# Altium project UPS.PrjPcb (part 1 of 3)
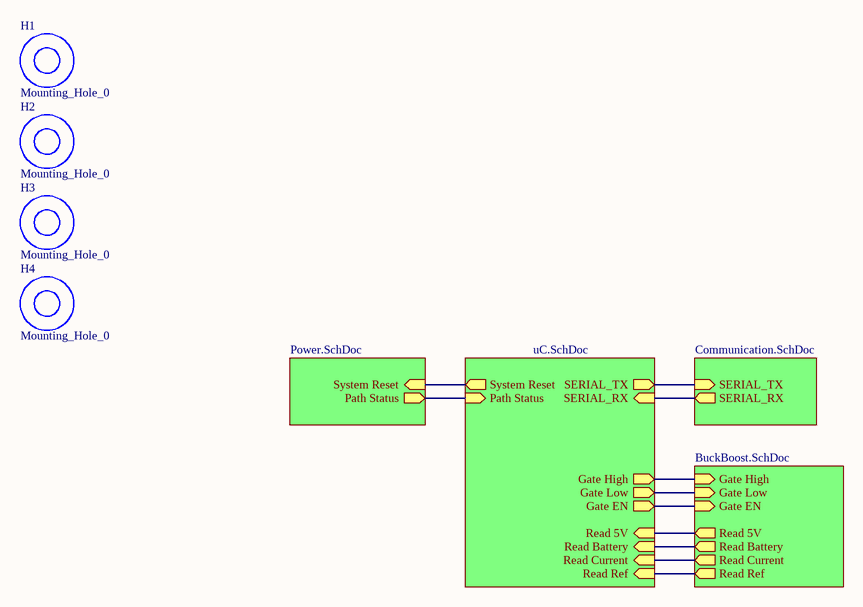
[diagram p0: Main.SchDoc]
5 sheets, 152 parts. Net scope: hierarchical (ports join the sheet entries above them; power ports are global).
Board file: UPS.PcbDoc
Sheets:
  Main.SchDoc
    Designator = uC.SchDoc
    Designator = Communication.SchDoc
    Designator = Power.SchDoc
    Designator = BuckBoost.SchDoc

## Sheet Main.SchDoc
size A4; SheetNumber: 1; SheetTotal: 5

### Parts
H1  Mounting_Hole_0  [MOUNTING_HOLE_M3]
H2  Mounting_Hole_0  [MOUNTING_HOLE_M3]
H3  Mounting_Hole_0  [MOUNTING_HOLE_M3]
H4  Mounting_Hole_0  [MOUNTING_HOLE_M3]

### Sub-sheets
Designator = uC.SchDoc: SERIAL_TX (out), SERIAL_RX (in), System Reset (out), Gate Low (out), Gate EN (out), Read 5V (in), Read Battery (in), Read Current (in), Read Ref (in), Gate High (out), Path Status (in)
Designator = Communication.SchDoc: SERIAL_TX (in), SERIAL_RX (out)
Designator = Power.SchDoc: System Reset (in), Path Status (out)
Designator = BuckBoost.SchDoc: Gate Low (in), Gate EN (in), Read 5V (out), Read Battery (out), Read Current (out), Read Ref (out), Gate High (in)

### Nets
Gate EN: sheet Designator/Gate EN, sheet Designator/Gate EN
Gate High: sheet Designator/Gate High, sheet Designator/Gate High
Gate Low: sheet Designator/Gate Low, sheet Designator/Gate Low
Path Status: sheet Designator/Path Status, sheet Designator/Path Status
Read 5V: sheet Designator/Read 5V, sheet Designator/Read 5V
Read Battery: sheet Designator/Read Battery, sheet Designator/Read Battery
Read Current: sheet Designator/Read Current, sheet Designator/Read Current
Read Ref: sheet Designator/Read Ref, sheet Designator/Read Ref
SERIAL_RX: sheet Designator/SERIAL_RX, sheet Designator/SERIAL_RX
SERIAL_TX: sheet Designator/SERIAL_TX, sheet Designator/SERIAL_TX
System Reset: sheet Designator/System Reset, sheet Designator/System Reset

### Library data of the parts
H1-H4 = Mounting_Hole_0: Mounting hole with no connectivity.

## Sheet uC.SchDoc: uC.SchDoc
size A4; Author: Daniel Sinko; Revision: A; SheetNumber: 2; SheetTotal: 5
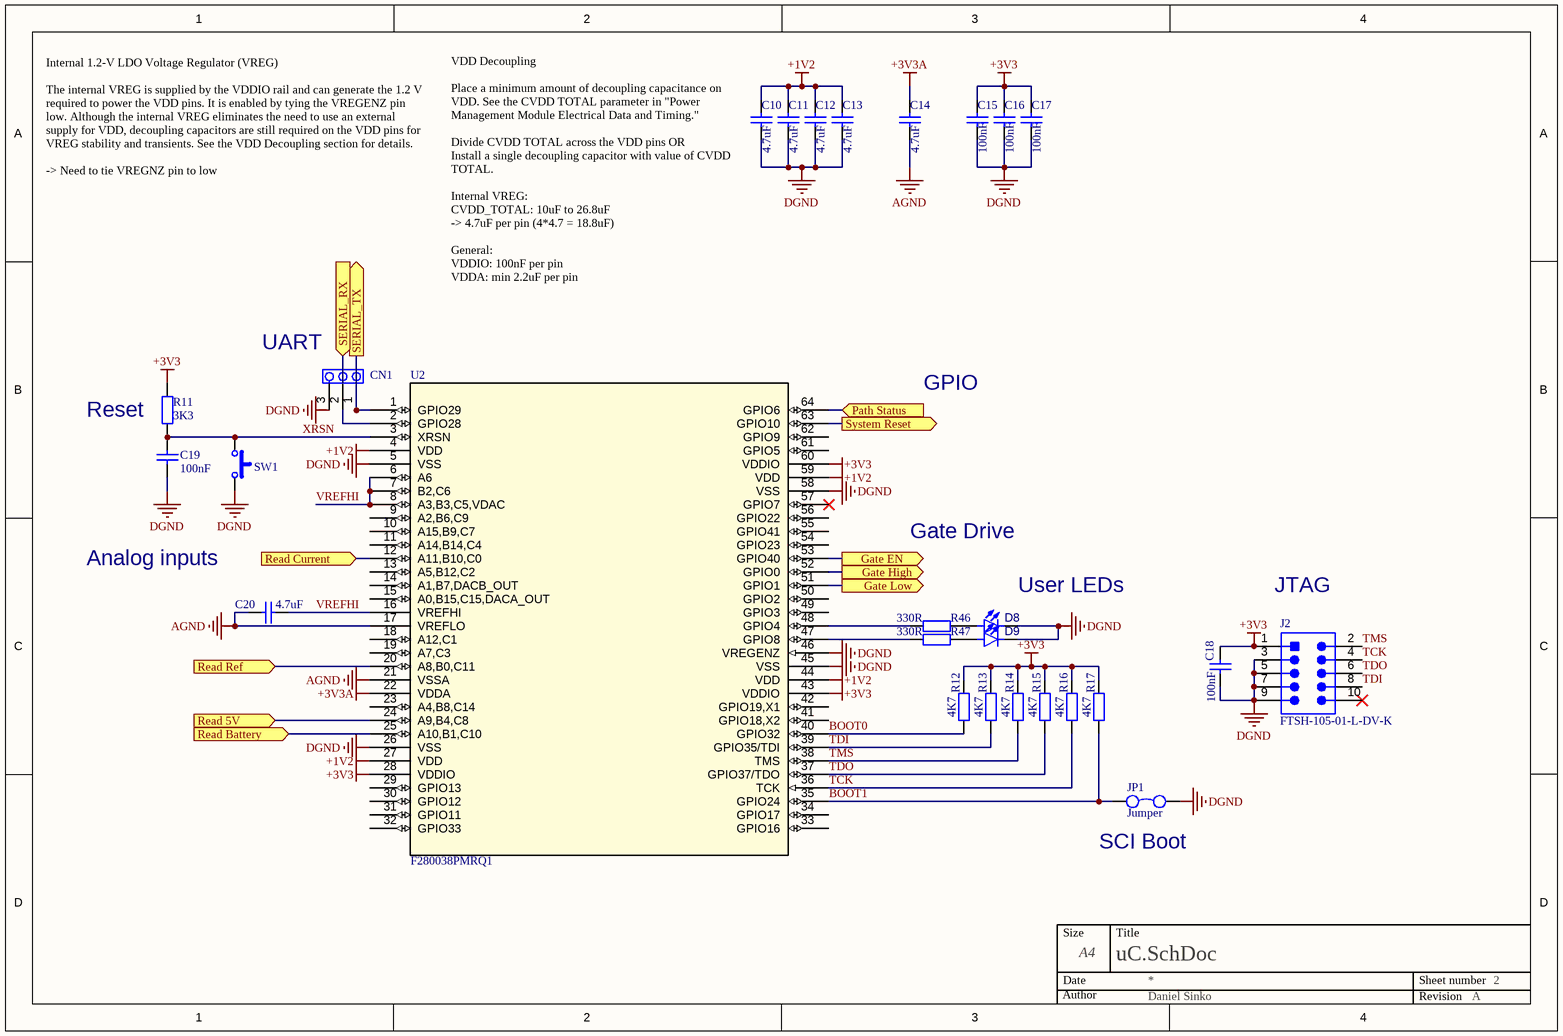
[diagram p1: uC.SchDoc]

### Parts
C10  4.7uF  [CAP0603]
C11  4.7uF  [CAP0603]
C12  4.7uF  [CAP0603]
C13  4.7uF  [CAP0603]
C14  4.7uF  [CAP0603]
C15  100nF  [CAP0603]
C16  100nF  [CAP0603]
C17  100nF  [CAP0603]
C18  100nF  [CAP0603]
C19  100nF  [CAP0603]
C20  4.7uF  [CAP0603]
CN1  Pins 1x3  [PIN-1X3]  (value not drawn)
D8  (no value)  [LED0603]
D9  (no value)  [LED0603]
J2  FTSH-105-01-L-DV-K  [CON-2x5-1.27]
JP1  Jumper  [PIN-1X2]
R11  3K3  [RES0603]
R12  4K7  [RES0603]
R13  4K7  [RES0603]
R14  4K7  [RES0603]
R15  4K7  [RES0603]
R16  4K7  [RES0603]
R17  4K7  [RES0603]
R46  330R  [RES0603]
R47  330R  [RES0603]
SW1  PTS526 Button  [PTS526 SMG15J SMTR2 LFS]  (value not drawn)
U2  F280038PMRQ1  [LQFP-64]

### Ports
Gate EN (out, see Main[3C], BuckBoost[1C]), Gate High (out, see Main[3C], BuckBoost[1B]), Gate Low (out, see Main[3C], BuckBoost[1C]), Path Status (in, see Main[2B], Power[1C]), Read 5V (in, see Main[3C], BuckBoost[1D]), Read Battery (in, see Main[3C], BuckBoost[1D]), Read Current (in, see Main[3C], BuckBoost[4D]), Read Ref (in, see Main[3C], BuckBoost[2D]), SERIAL_RX (in, see Main[3B], Communication[4A]), SERIAL_TX (out, see Main[3B], Communication[4A]), System Reset (out, see Main[2B], Power[3B])

### Nets
+1V2: C10.2 C11.2 C12.2 C13.2 U2.4(VDD) U2.27(VDD) U2.44(VDD) U2.59(VDD)
+3V3: C15.2 C16.2 C17.2 C18.2 J2.1 R11.2 R12.2 R13.2 R14.2 R15.2 R16.2 R17.2 U2.28(VDDIO) U2.43(VDDIO) U2.60(VDDIO)
+3V3A: C14.2 U2.22(VDDA)
AGND: C14.1 C20.1 U2.17(VREFLO) U2.21(VSSA)
DGND: C10.1 C11.1 C12.1 C13.1 C15.1 C16.1 C17.1 C18.1 C19.2 CN1.3 D8.1(K) D9.1(K) J2.3 J2.5 J2.7 J2.9 JP1.2 SW1.1 U2.5(VSS) U2.26(VSS) U2.45(VSS) U2.46(VREGENZ) U2.58(VSS)
BOOT0: R12.1 U2.40(GPIO32)
BOOT1: JP1.1 R17.1 U2.35(GPIO24)
Gate EN: U2.53(GPIO40) ; port Gate EN
Gate High: U2.52(GPIO0) ; port Gate High
Gate Low: U2.51(GPIO1) ; port Gate Low
Path Status: U2.64(GPIO6) ; port Path Status
Read 5V: U2.24(A9,B4,C8) ; port Read 5V
Read Battery: U2.25(A10,B1,C10) ; port Read Battery
Read Current: U2.12(A11,B10,C0) ; port Read Current
Read Ref: U2.20(A8,B0,C11) ; port Read Ref
SERIAL_TX: CN1.1 U2.1(GPIO29) ; port SERIAL_TX
System Reset: U2.63(GPIO10) ; port System Reset
TCK: J2.4 R16.1 U2.36(TCK)
TDI: J2.8 R13.1 U2.39(GPIO35/TDI)
TDO: J2.6 R15.1 U2.37(GPIO37/TDO)
TMS: J2.2 R14.1 U2.38(TMS)
VREFHI: C20.2 U2.6(A6) U2.7(B2,C6) U2.8(A3,B3,C5,VDAC) U2.16(VREFHI)
XRSN: C19.1 R11.1 SW1.2 U2.3(XRSN)
NetCN1_2: CN1.2 U2.2(GPIO28)
NetD8_2: D8.2(A) R46.1
NetD9_2: D9.2(A) R47.1
NetR46_2: R46.2 U2.48(GPIO4)
NetR47_2: R47.2 U2.47(GPIO8)

Not connected (* = marked no-connect by the designer): J2 10*; U2 9(A2,B6,C9) 10(A15,B9,C7) 11(A14,B14,C4) 13(A5,B12,C2) 14(A1,B7,DACB_OUT) 15(A0,B15,C15,DACA_OUT) 18(A12,C1) 19(A7,C3) 23(A4,B8,C14) 29(GPIO13) 30(GPIO12) 31(GPIO11) 32(GPIO33) 33(GPIO16) 34(GPIO17) 41(GPIO18,X2) 42(GPIO19,X1) 49(GPIO3) 50(GPIO2) 54(GPIO23) 55(GPIO41) 56(GPIO22) 57(GPIO7)* 61(GPIO5) 62(GPIO9)

### Notes on the sheet
- Internal 1.2-V LDO Voltage Regulator (VREG)
  The internal VREG is supplied by the VDDIO rail and can generate the 1.2 V required to power the VDD pins. It is enabled by tying the VREGENZ pin low. Although the internal VREG eliminates the need to use an external supply for VDD, decoupling capacitors are still required on the VDD pins for VREG stability and transients. See the VDD Decoupling section for details.
  -> Need to tie VREGNZ pin to low
- (near C10) VDD Decoupling
  Place a minimum amount of decoupling capacitance on VDD. See the CVDD TOTAL parameter in "Power Management Module Electrical Data and Timing."
  Divide CVDD TOTAL across the VDD pins OR
  Install a single decoupling capacitor with value of CVDD TOTAL.
  Internal VREG:
  CVDD_TOTAL: 10uF to 26.8uF
  -> 4.7uF per pin (4*4.7 = 18.8uF)
  General:
  VDDIO: 100nF per pin
  VDDA: min 2.2uF per pin
- (near CN1) UART
- Reset
- GPIO
- Analog inputs
- Gate Drive
- User LEDs
- (near J2) JTAG
- (near JP1) SCI Boot
- Size
- Date
- A4
- Title
- Sheet number
- Author
- Revision

### Library data of the parts
C10-C14 C20 = 4.7uF: Capacitor Ceramic 4.7uF 10V X5R 10% 0603 T/R; Manufacturer: Samsung; Manufacturer Part Number: CL10A475KP8NNWC; Voltage: *; Value: 4.7uF; Supplier: Mouser; Supplier Part Number: 187-CL10A475KP8NNWC; RoHS: No; Category: Ceramic Capacitors; Stock: 20365; Pricing: 1=0.1, 10=0.024, 50=0.024, 100=0.021, 1000=0.012, 10000=0.009 (USD)
C15-C19 = 100nF: Ceramic Capacitor, Multilayer, Ceramic, 25V, 10% +Tol, 10% -Tol, X7R, 15% TC, 0.1uF, Surface Mount, 0603; Manufacturer: Samsung; Manufacturer Part Number: CL10B104KA8WPNC; Multilayer: Yes; Reference Standard: AEC-Q200; Voltage: *; Value: 100nF; Supplier: Mouser; Supplier Part Number: 187-CL10B104KA8WPNC; RoHS: Yes; Category: Ceramic Capacitors; Stock: 62899; Pricing: 1=0.1, 10=0.026, 50=0.026, 100=0.018, 1000=0.014, 10000=0.009 (USD); Mounting Technology: Surface Mount; Pins: 2; Dielectric Material: Ceramic; Package Shape: Rectangular; Case/Package: 0603; Terminal Finish: Nickel; Min Operating Temperature: -55°C; Max Operating Temperature: 125°C; JESD-609 Code: e3; Capacitor Type: Ceramic; Tolerance  (fill in as +-): 10%; Packaging: Tape and Reel; Tolerance (fill in as +-): 10%; Rated DC Voltage (URdc): 25V; Temperature Characteristics Code: X7R; Termination: Wraparound; Reach SVHC Compliant: Yes; RoHS Compliant: Yes; ComponentLink1URL: https://datasheet.ciiva.com:443/pdfs/VipMasterIC/IC/SEMS/SEMS-S-A0005596039/SEMS-S-A0005592818-1.pdf?src-supplier=IHS+Markit; ComponentLink1Description: https://datasheet.ciiva.com:443/pdfs/VipMasterIC/IC/SEMS/SEMS-S-A0005596039/SEMS-S-A0005592818-1.pdf?src-supplier=IHS+Markit; ComponentLink2URL: http://www.samsungsem.com/kr/support/library/product-catalog/mlcc.jsp?src-supplier=Digikey; ComponentLink2Description: http://www.samsungsem.com/kr/support/library/product-catalog/mlcc.jsp?src-supplier=Digikey; ComponentLink3URL: http://www.samsungsem.com/kr/support/product-search/mlcc/CL10B104KA8WPNC.jsp?src-supplier=Digikey; ComponentLink3Description: http://www.samsungsem.com/kr/support/product-search/mlcc/CL10B104KA8WPNC.jsp?src-supplier=Digikey; ComponentLink4URL: http://www.samsungsem.com/servlet/FileDownload?filename=productcatalog/pdf/MLCC.pdf&src-supplier=Avnet; ComponentLink4Description: http://www.samsungsem.com/servlet/FileDownload?filename=productcatalog/pdf/MLCC.pdf&src-supplier=Avnet; ComponentLink5URL: https://datasheet.octopart.com/CL10B104KA8WPNC-Samsung-Electro-Mechanics-datasheet-148763375.pdf?src-supplier=Future+Electronics; ComponentLink5Description: https://datasheet.octopart.com/CL10B104KA8WPNC-Samsung-Electro-Mechanics-datasheet-148763375.pdf?src-supplier=Future+Electronics; ComponentLink6URL: https://datasheet.octopart.com/CL10B104KA8WPNC-Samsung-datasheet-8326407.pdf?src-supplier=TME; ComponentLink6Description: https://datasheet.octopart.com/CL10B104KA8WPNC-Samsung-datasheet-8326407.pdf?src-supplier=TME
CN1 = Pins 1x3: 1x3 2.54mm; Part Class: Connector; Order Code: 855-M50-3530342; CompType: M50-3530342; Distributor: Mouser; Package: SMD 1.27mm
D8 D9 = LED Green: Single Color LED, Bright Green, Water Clear, 1.1mm; Manufacturer: Wurth Electronics; Manufacturer Part Number: 150060VS75000; Shape: Rectangular; Forward Current: 30mA; Luminous Intensity-Nom: 40mcd; Channels: 1; Viewing Angle: 140°; Overall Height: 0.7mm; Supplier: Mouser; Supplier Part Number: 710-150060VS75000; RoHS: Yes; Category: LEDs; Stock: 96633; Pricing: 1=0.15, 10=0.15, 50=0.142, 100=0.122, 1000=0.116, 10000=0.116 (USD); Mounting Technology: Surface Mount; Pins: 2; Color: Green; Min Operating Temperature: -40°C; Max Operating Temperature: 85°C; Lens Style: WATER CLEAR; Optoelectronic Device Type: SINGLE COLOR LED; Packaging: Tape and Reel; Size: 1.1mm; Terminal Pitch: 1.6mm; Reach SVHC Compliant: Yes; RoHS Compliant: Yes; ComponentLink1URL: https://datasheet.ciiva.com:443/pdfs/VipMasterIC/IC/MIDC/MIDC-S-A0007768636/MIDC-S-A0007768636-1.pdf?src-supplier=IHS+Markit; ComponentLink1Description: https://datasheet.ciiva.com:443/pdfs/VipMasterIC/IC/MIDC/MIDC-S-A0007768636/MIDC-S-A0007768636-1.pdf?src-supplier=IHS+Markit; ComponentLink2URL: https://datasheet.ciiva.com/29562/150060vs75000-29562919.pdf?src-supplier=Digikey; ComponentLink2Description: https://datasheet.ciiva.com/29562/150060vs75000-29562919.pdf?src-supplier=Digikey
J2 = Connector_10Pin: Board Connector, 10 Contact(s), 2 Row(s), Male, Straight, 0.05 inch Pitch, Surface Mount Terminal, Locking; Manufacturer: Samtec; Manufacturer Part Number: FTSH-105-01-L-DV-K-P-TR; Connector Type: Header; Max Voltage: 0V; Current capacity: 3.4A; Safety Related: No; Order Code: 200-FTSH10501LDVK; Option: General Purpose; Contact Pattern: RECTANGULAR; Contact Style: SQ PIN-SKT; Mating Information: MULTIPLE MATING PARTS AVAILABLE; Number Of Connectors: 1; Number Of PCB Rows: 2; Number of Contacts: 10; Body Breadth: 0.135inch; Body Length: 0.25inch; PCB Contact Row Spacing: 4.064mm; Plating Thickness: 10uin; Reference Standard: UL; Reliability: COMMERCIAL; RoHS Compliant: Yes; Min Operating Temperature: -55°C; Mounting Technology: SMD; Gender: Male; Pins: 10; Max Operating Temperature: 125°C; Distributor: Mouser; Package: SMD; CompType: FTSH-105-01-L-DV-K; Supplier: Mouser; Supplier Part Number: 200-FTSH10501LDVKP; RoHS: Yes; Category: Headers and Wire Housings; Stock: 22779; Pricing: 1=2.88, 10=2.88, 50=2.88, 100=2.27, 1000=1.59, 10000=1.34 (USD); Contact Material: Bronze; Contact Finish - Mating: GOLD (10) OVER NICKEL (50); Contact Finish - Termination: Matte Tin (Sn) - with Nickel (Ni) barrier; Insulation Material: Polymer; JESD-609 Code: e3; Contact Gender: Male; Filter Feature: No; Mixed Contacts: No; Mounting Style: STRAIGHT; Number of Rows Loaded: 2; PCB Contact Pattern: RECTANGULAR; Termination: SMD/SMT; Mating Contact Pitch: 0.05inch; Mating Contact Row Spacing: 0.05inch; Mounting Option 1: LOCKING; Terminal Pitch: 1.27mm; DIN Conformance: No; IEC Conformance: No; MIL Conformance: No; Reach SVHC Compliant: Yes; ComponentLink1URL: https://datasheet.ciiva.com:443/pdfs/VipMasterIC/IC/SAMI/SAMI-S-A0006911451/SAMI-S-A0006911451-1.pdf?src-supplier=IHS+Markit; ComponentLink1Description: https://datasheet.ciiva.com:443/pdfs/VipMasterIC/IC/SAMI/SAMI-S-A0006911451/SAMI-S-A0006911451-1.pdf?src-supplier=IHS+Markit; ComponentLink2URL: https://datasheet.ciiva.com/26837/getdatasheetpartid-233500-26837930.pdf?src-supplier=Verical; ComponentLink2Description: https://datasheet.ciiva.com/26837/getdatasheetpartid-233500-26837930.pdf?src-supplier=Verical; ComponentLink3URL: https://datasheet.ciiva.com/10245/ftsh-mt-10245287.pdf?src-supplier=Avnet; ComponentLink3Description: https://datasheet.ciiva.com/10245/ftsh-mt-10245287.pdf?src-supplier=Avnet
JP1 = Jumper: Interconnection Device; Manufacturer: Harwin; Manufacturer Part Number: M7582-46; Manufacturer Series: M75; Additional Feature: ROHS COMPLIANT; Body/Shell Style: PLUG; Contact Pattern: RECTANGULAR; Contact Resistance: 20mR; Contact Style: SQ PIN-SKT; Dielectric Withstanding Voltage (AC): 500V; Insertion Force-Max: 6.672N; Insulation Resistance: 5GR; Number Of Connectors: 1; Rated Current (Signal): 1A; Number of Contacts: 2; Body Breadth: 0.094inch; Body Depth: 0.236inch; Body Length: 0.197inch; Mating Contact Pitch: 0.1inch; Reference Standard: UL; Reliability: COMMERCIAL; Supplier: Mouser; Supplier Part Number: 855-M7582-46; RoHS: Yes; Category: Uncategorized; Stock: 4991; Pricing: 1=0.19, 10=0.125, 50=0.125, 100=0.104, 1000=0.075, 10000=0.072 (USD); Contact Material: Bronze; Contact Finish - Mating: SN; Contact Finish - Termination: Tin (Sn); Insulation Color: Black; Insulation Material: Glass; Min Operating Temperature: -55°C; Max Operating Temperature: 105°C; Connector Type: Interconnection Device; JESD-609 Code: e3; Contact Gender: Female; Mounting Style: STRAIGHT; Number of Rows Loaded: 1; Reach SVHC Compliant: Yes; RoHS Compliant: Yes; ComponentLink1URL: https://datasheet.ciiva.com:443/pdfs/VipMasterIC/IC/HRWN/HRWNS06295/HRWNS06295-1.pdf?src-supplier=IHS+Markit; ComponentLink1Description: https://datasheet.ciiva.com:443/pdfs/VipMasterIC/IC/HRWN/HRWNS06295/HRWNS06295-1.pdf?src-supplier=IHS+Markit; ComponentLink2URL: http://www.mouser.com/ds/2/181/M7580-M7583-351524.pdf?src-supplier=Mouser; ComponentLink2Description: http://www.mouser.com/ds/2/181/M7580-M7583-351524.pdf?src-supplier=Mouser; ComponentLink3URL: https://cdn.harwin.com/pdfs/Harwin_PC_Connectors_M20.pdf?src-supplier=Digikey; ComponentLink3Description: https://cdn.harwin.com/pdfs/Harwin_PC_Connectors_M20.pdf?src-supplier=Digikey; ComponentLink4URL: http://www.harwin.com/include/downloads/pdfs/2010PAGE125.PDF?src-supplier=Avnet; ComponentLink4Description: http://www.harwin.com/include/downloads/pdfs/2010PAGE125.PDF?src-supplier=Avnet
R11 = 3K3: Fixed Resistor, Metal Glaze/thick Film, 0.1W, 3300ohm, 75V, 1% +/-Tol, 100ppm/Cel, Surface Mount, 0603; Manufacturer: Yageo; Manufacturer Part Number: RC0603FR-073K3L; Power: 100mW; Additional Feature: LASER TRIMMABLE; Rated Temperature: 70°C; Temperature Coefficient: 100ppm/°C; Package Height: 0.45mm; Package Length: 1.6mm; Package Width: 0.8mm; Supplier: Mouser; Tolerance: 1%; Supplier Part Number: 603-RC0603FR-073K3L; RoHS: Yes; Category: Chip SMD Resistors; Stock: 104017; Pricing: 1=0.1, 10=0.012, 50=0.012, 100=0.007, 1000=0.005, 10000=0.004 (USD); Mounting Technology: Surface Mount; Pins: 2; Package Shape: Rectangular; Case/Package: 0603; Terminal Finish: Nickel; Min Operating Temperature: -55°C; Max Operating Temperature: 155°C; JESD-609 Code: e3; Resistor Type: FIXED RESISTOR; Packaging: Tape and Reel; Technology: METAL GLAZE/THICK FILM; Termination: Wraparound; Working Voltage: 75V; Reach SVHC Compliant: Yes; RoHS Compliant: Yes; ComponentLink1URL: https://datasheet.ciiva.com:443/pdfs/VipMasterIC/IC/YAGO/YAGO-S-A0008145938/YAGO-S-A0008145938-1.pdf?src-supplier=IHS+Markit; ComponentLink1Description: https://datasheet.ciiva.com:443/pdfs/VipMasterIC/IC/YAGO/YAGO-S-A0008145938/YAGO-S-A0008145938-1.pdf?src-supplier=IHS+Markit; ComponentLink2URL: https://datasheet.ciiva.com/7746/1686128-7746345.pdf?src-supplier=Element14; ComponentLink2Description: https://datasheet.ciiva.com/7746/1686128-7746345.pdf?src-supplier=Element14; ComponentLink3URL: https://datasheet.ciiva.com/46440/1868787-46440905.pdf?src-supplier=Element14; ComponentLink3Description: https://datasheet.ciiva.com/46440/1868787-46440905.pdf?src-supplier=Element14; Value: 3K3; Construction: Chip; ComponentLink4URL: https://datasheet.ciiva.com/2453/pyu-r-int-thick-7-2453926.pdf?src-supplier=Digikey; ComponentLink4Description: https://datasheet.ciiva.com/2453/pyu-r-int-thick-7-2453926.pdf?src-supplier=Digikey; ComponentLink5URL: https://datasheet.ciiva.com/2453/pyu-r-int-thick-7-2453927.pdf?src-supplier=Digikey; ComponentLink5Description: https://datasheet.ciiva.com/2453/pyu-r-int-thick-7-2453927.pdf?src-supplier=Digikey; ComponentLink6URL: https://datasheet.ciiva.com/7746/443971-7746344.pdf?src-supplier=Element14; ComponentLink6Description: https://datasheet.ciiva.com/7746/443971-7746344.pdf?src-supplier=Element14; ComponentLink7URL: https://datasheet.ciiva.com/7746/443971-7746346.pdf?src-supplier=Element14; ComponentLink7Description: https://datasheet.ciiva.com/7746/443971-7746346.pdf?src-supplier=Element14
R12-R17 = 4K7: Fixed Resistor, Metal Glaze/thick Film, 0.1W, 4700ohm, 75V, 1% +/-Tol, 100ppm/Cel, Surface Mount, 0603; Manufacturer: Yageo; Manufacturer Part Number: AC0603FR-134K7L; Additional Feature: LASER TRIMMABLE; Rated Temperature: 70°C; Temperature Coefficient: 100ppm/°C; Package Height: 0.45mm; Package Length: 1.6mm; Package Width: 0.8mm; Reference Standard: AEC-Q200; Value: 4K7; Supplier Part Number: 603-AC0603FR-134K7L; RoHS: Yes; Category: Chip SMD Resistors; Stock: 48833; Pricing: 1=0.1, 10=0.009, 50=0.009, 100=0.006, 1000=0.005, 10000=0.003 (USD); Mounting Technology: Surface Mount; Pins: 2; Package Shape: Rectangular; Case/Package: 0603; Terminal Finish: Nickel; Min Operating Temperature: -55°C; Max Operating Temperature: 155°C; JESD-609 Code: e3; Resistor Type: FIXED RESISTOR; Construction: Chip; Packaging: Tape and Reel; Technology: METAL GLAZE/THICK FILM; Termination: Wraparound; Working Voltage: 75V; Reach SVHC Compliant: Yes; RoHS Compliant: Yes; ComponentLink1URL: https://datasheet.ciiva.com:443/pdfs/VipMasterIC/IC/YAGO/YAGO-S-A0003597364/YAGO-S-A0003597364-1.pdf?src-supplier=IHS+Markit; ComponentLink1Description: https://datasheet.ciiva.com:443/pdfs/VipMasterIC/IC/YAGO/YAGO-S-A0003597364/YAGO-S-A0003597364-1.pdf?src-supplier=IHS+Markit; ComponentLink2URL: https://datasheet.octopart.com/AC0603FR-134K7L-Yageo-datasheet-151884373.pdf?src-supplier=Future+Electronics; ComponentLink2Description: https://datasheet.octopart.com/AC0603FR-134K7L-Yageo-datasheet-151884373.pdf?src-supplier=Future+Electronics
R46 R47 = 330R: Fixed Resistor, Metal Glaze/thick Film, 0.1W, 330ohm, 75V, 1% +/-Tol, 100ppm/Cel, Surface Mount, 0603; Manufacturer: Walsin Technologies; Manufacturer Part Number: WR06X3300FTL; Rated Temperature: 70°C; Temperature Coefficient: 100ppm/°C; Working Voltage: 50V; Package Height: 0.45mm; Package Length: 1.6mm; Package Width: 0.8mm; Value: 330R; Supplier Part Number: 791-WR06X3300FTL; RoHS: Yes; Category: Chip SMD Resistors; Stock: 10415; Pricing: 1=0.1, 10=0.007, 50=0.007, 100=0.003, 1000=0.003, 10000=0.001 (USD); Mounting Technology: Surface Mount; Pins: 2; Package Shape: Rectangular; Case/Package: 0603; Terminal Finish: Nickel; Min Operating Temperature: -55°C; Max Operating Temperature: 155°C; JESD-609 Code: e3; Resistor Type: FIXED RESISTOR; Packaging: Tape and Reel; Termination: Wraparound; Construction: Chip; Technology: METAL GLAZE/THICK FILM; Reach SVHC Compliant: Yes; RoHS Compliant: Yes; ComponentLink1URL: https://datasheet.ciiva.com:443/pdfs/VipMasterIC/IC/WATC/WATC-S-A0005256878/WATC-S-A0005256878-1.pdf?src-supplier=IHS+Markit; ComponentLink1Description: https://datasheet.ciiva.com:443/pdfs/VipMasterIC/IC/WATC/WATC-S-A0005256878/WATC-S-A0005256878-1.pdf?src-supplier=IHS+Markit; ComponentLink2URL: http://www.farnell.com/datasheets/1960319.pdf?src-supplier=Farnell; ComponentLink2Description: http://www.farnell.com/datasheets/1960319.pdf?src-supplier=Farnell; ComponentLink3URL: https://datasheet.octopart.com/WR06X3300FTL-Walsin-Technologies-datasheet-48038251.pdf?src-supplier=Element14; ComponentLink3Description: https://datasheet.octopart.com/WR06X3300FTL-Walsin-Technologies-datasheet-48038251.pdf?src-supplier=Element14; ComponentLink4URL: https://www.verical.com/server-webapp/html/getDatasheet?partID=414704&src-supplier=Verical; ComponentLink4Description: https://www.verical.com/server-webapp/html/getDatasheet?partID=414704&src-supplier=Verical
SW1 = PTS526 Button: PTS526 Series SPST-NO Off-Mom 160 gf Top Actuated J Lead SMT Tactile Switch; Part Class: Other; Manufacturer: ITT C&K; Manufacturer Part Number: PTS526SMG15JSMTR2LFS; CompType: DTSM 32N/SMD; Note: DIPTRONICS; Distributor: RET; Order Code: 52-01-71; Supplier: Mouser; Supplier Part Number: 611-TS526SMG15JSMR2L; RoHS: No; Category: Tactile Switches; Stock: 4081; Pricing: 1=0.14, 10=0.118, 50=0.118, 100=0.112, 1000=0.086, 10000=0.083 (USD); ComponentLink1URL: https://dznh3ojzb2azq.cloudfront.net/products/Tactile/PTS526/documents/datasheet.pdf?src-supplier=Digikey; ComponentLink1Description: https://dznh3ojzb2azq.cloudfront.net/products/Tactile/PTS526/documents/datasheet.pdf?src-supplier=Digikey; ComponentLink2URL: https://datasheet.octopart.com/PTS526SMG15JSMTR2LFS-C%26K-Components-datasheet-138817219.pdf?src-supplier=Future+Electronics; ComponentLink2Description: https://datasheet.octopart.com/PTS526SMG15JSMTR2LFS-C%26K-Components-datasheet-138817219.pdf?src-supplier=Future+Electronics; ComponentLink3URL: https://datasheet.octopart.com/PTS526SMG15JSMTR2LFS-C%26K-Components-datasheet-166147767.pdf?src-supplier=TME; ComponentLink3Description: https://datasheet.octopart.com/PTS526SMG15JSMTR2LFS-C%26K-Components-datasheet-166147767.pdf?src-supplier=TME
U2 = F280038CPMRQ1: Automotive C2000™ 32-bit MCU 120-MHz 384-KB flash, FPU, TMU with CLA, AES and CAN-FD; Mfr_Name: Texas Instruments; CompType: TMS320F280038-Q1; Type: DEV; Copyright: Copyright (C) 2023 Ultra Librarian. All rights reserved.; Manufacturer_Part_Number: F280038PMRQ1; RefDes: RefDes; Footprint: LQFP64; Distributor: TI; Supplier: Mouser; Supplier Part Number: 595-F280038PMRQ1; Manufacturer: Texas Instruments; Manufacturer Part Number: F280038PMRQ1; RoHS: No; Category: Uncategorized; Stock: 993; Pricing: 1=7.79, 10=7.04, 50=6.72, 100=5.83, 1000=4.35, 10000=4.35 (USD)

## Sheet Communication.SchDoc
size A4; SheetNumber: 4; SheetTotal: 5
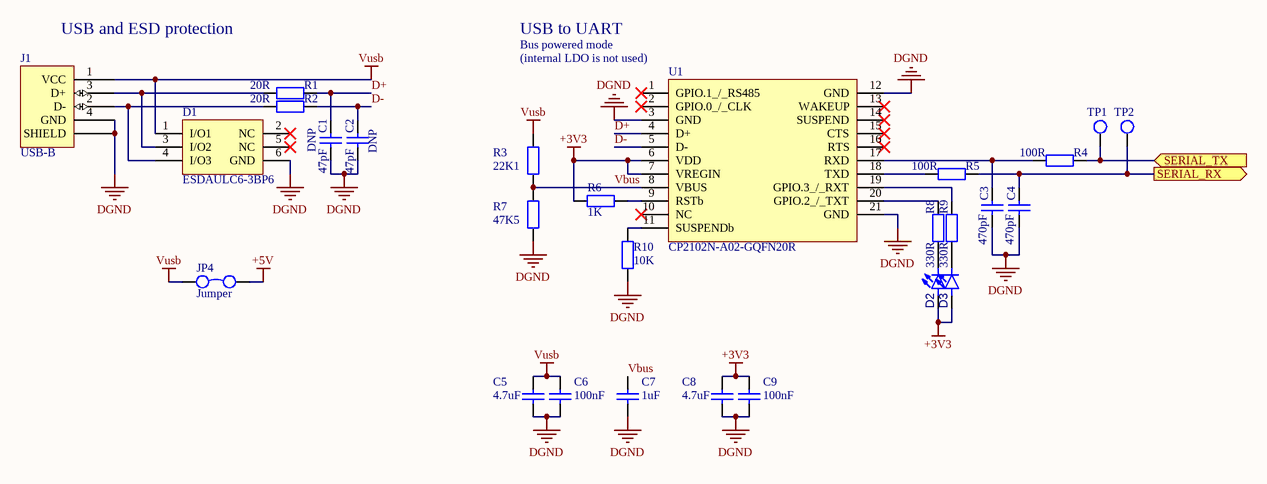
[diagram p2: Communication.SchDoc]

### Parts
C1  DNP  value 47pF  [CAP0603]
C2  DNP  value 47pF  [CAP0603]
C3  470pF  [CAP0603]
C4  470pF  [CAP0603]
C5  4.7uF  [CAP0603]
C6  100nF  [CAP0603]
C7  1uF  [CAP0603]
C8  4.7uF  [CAP0603]
C9  100nF  [CAP0603]
D1  ESDAULC6-3BP6  [SOT-666]
D2  (no value)  [LED0603]
D3  (no value)  [LED0603]
J1  USB-B  [USB-B-FEMALE]
JP4  Jumper  [PIN-1X2]
R1  20R  [RES0603]
R2  20R  [RES0603]
R3  22K1  [RES0603]
R4  100R  [RES0603]
R5  100R  [RES0603]
R6  1K  [RES0603]
R7  47K5  [RES0603]
R8  330R  [RES0603]
R9  330R  [RES0603]
R10  10K  [RES0603]
TP1  Test Point  [TP-1.5HOLE]  (value not drawn)
TP2  Test Point  [TP-1.5HOLE]  (value not drawn)
U1  CP2102N-A02-GQFN20R  [QFN-20]

### Ports
SERIAL_RX (out, see Main[2B], uC[1B]), SERIAL_TX (in, see Main[2B], uC[1B])

### Nets
+3V3: C8.2 C9.1 D2.2(A) D3.2(A) R6.1 U1.6(VDD) U1.7(VREGIN)
+5V: JP4.2
DGND: C1.1 C2.1 C3.1 C4.1 C5.1 C6.2 C7.1 C8.1 C9.2 D1.6(GND) J1.0(SHIELD) J1.4(GND) R7.1 R10.1 U1.3(GND) U1.12(GND) U1.21(GND)
Vusb: C5.2 C6.1 D1.1(I/O1) J1.1(VCC) JP4.1 R3.2
D+: C1.2 R1.1 U1.4(D+)
D-: C2.2 R2.1 U1.5(D-)
SERIAL_RX: C4.2 R5.2 TP2.1 ; port SERIAL_RX
SERIAL_TX: R4.2 TP1.1 ; port SERIAL_TX
Vbus: C7.2 R3.1 R7.2 U1.8(VBUS)
NetC3_2: C3.2 R4.1 U1.17(RXD)
NetD1_3: D1.3(I/O2) J1.3(D+) R1.2
NetD1_4: D1.4(I/O3) J1.2(D-) R2.2
NetD2_1: D2.1(K) R8.2
NetD3_1: D3.1(K) R9.2
NetR5_1: R5.1 U1.18(TXD)
NetR6_2: R6.2 U1.9(RSTb)
NetR8_1: R8.1 U1.20(GPIO.2_/_TXT)
NetR9_1: R9.1 U1.19(GPIO.3_/_RXT)
NetR10_2: R10.2 U1.11(SUSPENDb)

Not connected (* = marked no-connect by the designer): D1 2(NC)* 5(NC)*; U1 1(GPIO.1_/_RS485)* 2(GPIO.0_/_CLK)* 10(NC)* 13(WAKEUP)* 14(SUSPEND)* 15(CTS)* 16(RTS)*

### Notes on the sheet
- USB and ESD protection
- USB to UART
- Bus powered mode
- (near U1) (internal LDO is not used)

### Library data of the parts
C1 C2 = 47pF: Ceramic Capacitor, Multilayer, Ceramic, 100V, 5% +Tol, 5% -Tol, C0G, 30ppm/Cel TC, 0.000047uF, Surface Mount, 0603; Manufacturer: KEMET; Manufacturer Part Number: C0603C470J1GACTU; Multilayer: Yes; Voltage: *; Supplier: Mouser; Supplier Part Number: 80-C0603C470J1G; RoHS: Yes; Category: Ceramic Capacitors; Stock: 43381; Pricing: 1=0.1, 10=0.026, 50=0.026, 100=0.016, 1000=0.012, 10000=0.007 (USD); Mounting Technology: Surface Mount; Pins: 2; Dielectric Material: Ceramic; Package Shape: Rectangular; Case/Package: 0603; Terminal Finish: Nickel; Min Operating Temperature: -55°C; Max Operating Temperature: 125°C; JESD-609 Code: e3; Capacitor Type: Ceramic; Tolerance  (fill in as +-): 5%; Package Style: SMTMeter; Packaging: Tape and Reel; Tolerance (fill in as +-): 5%; Rated DC Voltage (URdc): 100V; Temperature Characteristics Code: C0G; Termination: Wraparound; Length: 1.6mm; Width: 0.8mm; Height: 0.8mm; Reach SVHC Compliant: Yes; RoHS Compliant: Yes; ComponentLink1URL: https://datasheet.ciiva.com:443/pdfs/VipMasterIC/IC/KEME/KEME-S-A0005605168/KEME-S-A0005605168-1.pdf?src-supplier=IHS+Markit; ComponentLink1Description: https://datasheet.ciiva.com:443/pdfs/VipMasterIC/IC/KEME/KEME-S-A0005605168/KEME-S-A0005605168-1.pdf?src-supplier=IHS+Markit; ComponentLink2URL: https://datasheet.ciiva.com/28668/1789732-28668693.pdf?src-supplier=Element14; ComponentLink2Description: https://datasheet.ciiva.com/28668/1789732-28668693.pdf?src-supplier=Element14; ComponentLink3URL: https://datasheet.ciiva.com/18193/getdatasheetpartid-544691-18193046.pdf?src-supplier=Verical; ComponentLink3Description: https://datasheet.ciiva.com/18193/getdatasheetpartid-544691-18193046.pdf?src-supplier=Verical; ComponentLink4URL: https://datasheet.ciiva.com/18101/getdatasheetpartid-38001-18101098.pdf?src-supplier=Verical; ComponentLink4Description: https://datasheet.ciiva.com/18101/getdatasheetpartid-38001-18101098.pdf?src-supplier=Verical
C3 C4 = 470pF: Ceramic Capacitor, Multilayer, Ceramic, 250V, 5% +Tol, 5% -Tol, C0G, 30ppm/Cel TC, 0.00047uF, Surface Mount, 0603; Manufacturer: KEMET; Manufacturer Part Number: C0603C471JAGACAUTO; Multilayer: Yes; Reference Standard: AEC-Q200; Supplier: Mouser; Supplier Part Number: 80-C0603C471JAGAUTO; RoHS: Yes; Category: Ceramic Capacitors; Stock: 51887; Pricing: 1=0.1, 10=0.068, 50=0.068, 100=0.034, 1000=0.022, 10000=0.017 (USD); Pins: 2; Dielectric Material: Ceramic; Case/Package: 0603; Terminal Finish: Nickel; Min Operating Temperature: -55°C; Max Operating Temperature: 125°C; JESD-609 Code: e3; Capacitor Type: Ceramic; Tolerance  (fill in as +-): 5%; Package Style: SMTMeter; Packaging: Tape and Reel; Tolerance (fill in as +-): 5%; Rated DC Voltage (URdc): 250V; Temperature Characteristics Code: C0G; Length: 1.6mm; Width: 0.8mm; Height: 0.8mm; Reach SVHC Compliant: Yes; RoHS Compliant: Yes; ComponentLink1URL: https://datasheet.ciiva.com:443/pdfs/VipMasterIC/IC/KEME/KEME-S-A0008958445/KEME-S-A0008958445-1.pdf?src-supplier=IHS+Markit; ComponentLink1Description: https://datasheet.ciiva.com:443/pdfs/VipMasterIC/IC/KEME/KEME-S-A0008958445/KEME-S-A0008958445-1.pdf?src-supplier=IHS+Markit; ComponentLink2URL: http://www.mouser.com/ds/2/212/KEM_C1086_U2J-962528.pdf?src-supplier=Mouser; ComponentLink2Description: http://www.mouser.com/ds/2/212/KEM_C1086_U2J-962528.pdf?src-supplier=Mouser; ComponentLink3URL: http://www.kemet.com/Lists/ProductCatalog/Attachments/420/KEM_C1022_C0G_AUTO_SMD.pdf?src-supplier=Digikey; ComponentLink3Description: http://www.kemet.com/Lists/ProductCatalog/Attachments/420/KEM_C1022_C0G_AUTO_SMD.pdf?src-supplier=Digikey; ComponentLink4URL: https://api.kemet.com/component-edge/download/datasheet/C0603C471JAGACAUTO.pdf?src-supplier=Digikey; ComponentLink4Description: https://api.kemet.com/component-edge/download/datasheet/C0603C471JAGACAUTO.pdf?src-supplier=Digikey; Value: 470pF
C5 C8 = 4.7uF: Capacitor; Voltage: *; Value: 4.7uF
C6 C9 = 100nF: Capacitor; Voltage: *; Value: 100nF
C7 = 1uF: Capacitor; Voltage: *; Value: 1uF
D1 = ESDAULC6-3BP6: TVS Diode (Bi-directional); Manufacturer_Name: STMicroelectronics; Datasheet Link: https://www.st.com/resource/en/datasheet/esdaulc6-3bp6.pdf; Height: 0.6mm; Manufacturer_Part_Number: ESDAULC6-3BP6; Mouser Part Number: 511-ESDAULC63BP6; Mouser Price/Stock: https://www.mouser.co.uk/ProductDetail/STMicroelectronics/ESDAULC6-3BP6?qs=eU2TTeT5rM3P6hIT2KJeMw%3D%3D; Arrow Part Number: ESDAULC6-3BP6; Arrow Price/Stock: https://www.arrow.com/en/products/esdaulc6-3bp6/stmicroelectronics?region=europe
D2 D3 = LED Green: as D8 on sheet uC; Supplier: Mouser; Supplier Part Number: 710-150060VS75000; RoHS: Yes; Category: LEDs; Stock: 96633; Pricing: 1=0.15, 10=0.15, 50=0.142, 100=0.122, 1000=0.116, 10000=0.116 (USD); Mounting Technology: Surface Mount; Pins: 2; Color: Green; Min Operating Temperature: -40°C; Max Operating Temperature: 85°C; Lens Style: WATER CLEAR; Optoelectronic Device Type: SINGLE COLOR LED; Packaging: Tape and Reel; Size: 1.1mm; Terminal Pitch: 1.6mm; Reach SVHC Compliant: Yes; RoHS Compliant: Yes; ComponentLink1URL: https://datasheet.ciiva.com:443/pdfs/VipMasterIC/IC/MIDC/MIDC-S-A0007768636/MIDC-S-A0007768636-1.pdf?src-supplier=IHS+Markit; ComponentLink1Description: https://datasheet.ciiva.com:443/pdfs/VipMasterIC/IC/MIDC/MIDC-S-A0007768636/MIDC-S-A0007768636-1.pdf?src-supplier=IHS+Markit; ComponentLink2URL: https://datasheet.ciiva.com/29562/150060vs75000-29562919.pdf?src-supplier=Digikey; ComponentLink2Description: https://datasheet.ciiva.com/29562/150060vs75000-29562919.pdf?src-supplier=Digikey
J1 = USB-B: USB Connector
JP4 = Jumper: 2 pin jumper connection
R1 R2 = 20R: Resistor; Value: 20R
R3 = 22K1: Resistor; Value: 22K1
R4 R5 = 100R: Resistor; Value: 100R
R6 = 1K: Resistor; Value: 1K
R7 = 47K5: Resistor; Value: 47K5
R8 R9 = 330R: Resistor; Value: 330R
R10 = 10K: Resistor; Value: 10K
U1 = CP2102N-A02-GQFN20R: USB-UART Bridge; Manufacturer_Name: Silicon Labs; Datasheet Link: https://www.silabs.com/documents/public/data-sheets/cp2102n-datasheet.pdf; Height: 0.8mm; Manufacturer_Part_Number: CP2102N-A02-GQFN20R; Mouser Part Number: 634-CP2102NA02QFN20R; Mouser Price/Stock: https://www.mouser.co.uk/ProductDetail/Silicon-Labs/CP2102N-A02-GQFN20R?qs=u16ybLDytRbf2uwPkMBdUg%3D%3D; Arrow Part Number: CP2102N-A02-GQFN20R; Arrow Price/Stock: https://www.arrow.com/en/products/cp2102n-a02-gqfn20r/silicon-labs?utm_currency=USD&region=nac